# Altium schematic sheet Analog Hall.SchDoc
size A4; CompanyName: Technische Hochschule Nürnberg Georg Simon Ohm; Organization: UltraZohm; Address1: Kesslerplatz 12; Address2: 90489 Nürnberg; Address3: GERMANY; DocumentNumber: 3; SheetNumber: 3; SheetTotal: 12; Website: www.ultrazohm.com
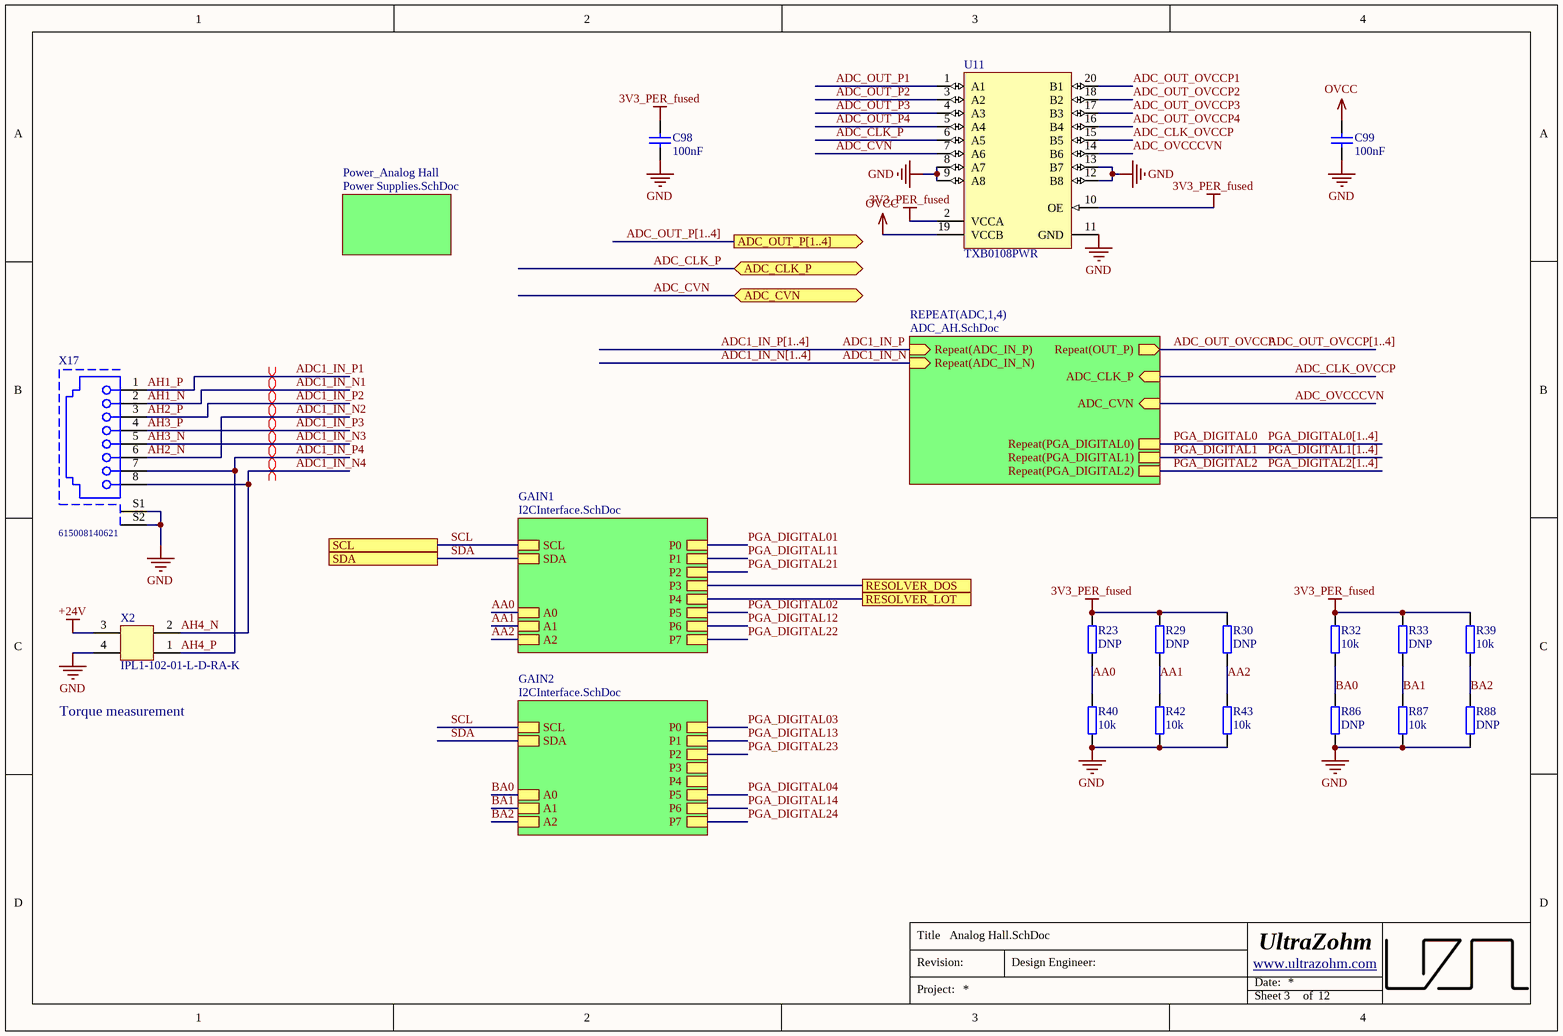
[diagram p0: Analog Hall.SchDoc]

## Parts
C98  100nF  [CAPC1608X07N]
C99  100nF  [CAPC1608X07N]
R23  DNP  [RESC1608X06N]
R29  DNP  [RESC1608X06N]
R30  DNP  [RESC1608X06N]
R32  10k  [RESC1608X06N]
R33  DNP  [RESC1608X06N]
R39  10k  [RESC1608X06N]
R40  10k  [RESC1608X06N]
R42  10k  [RESC1608X06N]
R43  10k  [RESC1608X06N]
R86  DNP  [RESC1608X06N]
R87  10k  [RESC1608X06N]
R88  DNP  [RESC1608X06N]
U11  TXB0108PWR  [PW0020A_L]
X2  IPL1-102-01-L-D-RA-K  [Conector 2x2 TH Horizontal]
X17  615008140621  [615008140621]

## Sub-sheets
GAIN1 = I2CInterface.SchDoc: P4, P7, SDA, P2, P1, A1, A2, P3, P6, SCL, A0, P0, P5
GAIN2 = I2CInterface.SchDoc: P4, P7, SDA, P2, P1, A1, A2, P3, P6, SCL, A0, P0, P5
Power_Analog Hall = Power Supplies.SchDoc: no entries
REPEAT(ADC,1,4) = ADC_AH.SchDoc: Repeat(ADC_IN_N) (in), Repeat(ADC_IN_P) (in), Repeat(OUT_P) (out), ADC_CLK_P (in), ADC_CVN (in), Repeat(PGA_DIGITAL0), Repeat(PGA_DIGITAL1), Repeat(PGA_DIGITAL2)

## Ports
ADC_CLK_P (bidir), ADC_CVN (bidir), ADC_OUT_P[1..4] (out), RESOLVER_DOS, RESOLVER_LOT, SCL, SDA

## Nets
3V3_PER_fused: C98.1 R23.2 R29.2 R30.2 R32.1 R33.1 R39.1 U11.2(VCCA) U11.10(OE)
+24V: X2.3
GND: C98.2 C99.2 R40.1 R42.1 R43.1 R86.2 R87.2 R88.2 U11.8(A7) U11.9(A8) U11.11(GND) U11.12(B8) U11.13(B7) X2.4 X17.S1 X17.S2
OVCC: C99.1 U11.19(VCCB)
AA0: R23.1 R40.2 ; sheet GAIN1/A0
AA1: R29.1 R42.2 ; sheet GAIN1/A1
AA2: R30.1 R43.2 ; sheet GAIN1/A2
ADC1_IN_N: sheet REPEAT(ADC,1,4)/Repeat(ADC_IN_N)
ADC1_IN_N1: X17.2  [also labelled AH1_N]
ADC1_IN_N2: X17.6  [also labelled AH2_N]
ADC1_IN_N3: X17.5  [also labelled AH3_N]
ADC1_IN_N4: X2.2 X17.8  [also labelled AH4_N]
ADC1_IN_P: sheet REPEAT(ADC,1,4)/Repeat(ADC_IN_P)
ADC1_IN_P1: X17.1  [also labelled AH1_P]
ADC1_IN_P2: X17.3  [also labelled AH2_P]
ADC1_IN_P3: X17.4  [also labelled AH3_P]
ADC1_IN_P4: X2.1 X17.7  [also labelled AH4_P]
ADC_CLK_OVCCP: U11.15(B5) ; sheet REPEAT(ADC,1,4)/ADC_CLK_P
ADC_CLK_P: U11.6(A5) ; port ADC_CLK_P
ADC_CVN: U11.7(A6) ; port ADC_CVN
ADC_OUT_OVCCP: sheet REPEAT(ADC,1,4)/Repeat(OUT_P)
ADC_OUT_OVCCP1: U11.20(B1)
ADC_OUT_OVCCP2: U11.18(B2)
ADC_OUT_OVCCP3: U11.17(B3)
ADC_OUT_OVCCP4: U11.16(B4)
ADC_OUT_P1: U11.1(A1)
ADC_OUT_P2: U11.3(A2)
ADC_OUT_P3: U11.4(A3)
ADC_OUT_P4: U11.5(A4)
ADC_OVCCCVN: U11.14(B6) ; sheet REPEAT(ADC,1,4)/ADC_CVN
BA0: R32.2 R86.1 ; sheet GAIN2/A0
BA1: R33.2 R87.1 ; sheet GAIN2/A1
BA2: R39.2 R88.1 ; sheet GAIN2/A2
PGA_DIGITAL0: sheet REPEAT(ADC,1,4)/Repeat(PGA_DIGITAL0)
PGA_DIGITAL1: sheet REPEAT(ADC,1,4)/Repeat(PGA_DIGITAL1)
PGA_DIGITAL01: sheet GAIN1/P0
PGA_DIGITAL2: sheet REPEAT(ADC,1,4)/Repeat(PGA_DIGITAL2)
PGA_DIGITAL02: sheet GAIN1/P5
PGA_DIGITAL03: sheet GAIN2/P0
PGA_DIGITAL04: sheet GAIN2/P5
PGA_DIGITAL11: sheet GAIN1/P1
PGA_DIGITAL12: sheet GAIN1/P6
PGA_DIGITAL13: sheet GAIN2/P1
PGA_DIGITAL14: sheet GAIN2/P6
PGA_DIGITAL21: sheet GAIN1/P2
PGA_DIGITAL22: sheet GAIN1/P7
PGA_DIGITAL23: sheet GAIN2/P2
PGA_DIGITAL24: sheet GAIN2/P7
RESOLVER_DOS: port RESOLVER_DOS, sheet GAIN1/P3
RESOLVER_LOT: port RESOLVER_LOT, sheet GAIN1/P4
SCL: port SCL, sheet GAIN1/SCL, sheet GAIN2/SCL
SDA: port SDA, sheet GAIN1/SDA, sheet GAIN2/SDA

## Buses and harness runs
bus ADC1_IN_N[1..4]
bus ADC1_IN_P[1..4]
bus ADC_OUT_OVCCP[1..4]
bus ADC_OUT_P[1..4] = port ADC_OUT_P[1..4]
bus PGA_DIGITAL0[1..4]
bus PGA_DIGITAL1[1..4]
bus PGA_DIGITAL2[1..4]

## Layout directives
differential pair: ADC1_IN_N1, ADC1_IN_N2, ADC1_IN_N3, ADC1_IN_N4, ADC1_IN_P1, ADC1_IN_P2, ADC1_IN_P3, ADC1_IN_P4

## Notes on the sheet
- (near X2) Torque measurement
- Title
- Revision:
- Design Engineer:
- Date:
- Project:
- Sheet
- of

## Library data of the parts
C98 = Cap_0603: MPN: 885012206071; MF: Würth; Voltage: 25V; Value: 100nF; Supplier 1: Mouser; Supplier 2: *; Supplier Part Number 1: 710-885012206071; Supplier Part Number 2: *
C99 = Cap_0603: MPN: 885012206071; MF: Würth; Voltage: 16V; Value: 100nF; Supplier 1: Mouser; Supplier 2: *; Supplier Part Number 1: 710-885012206071; Supplier Part Number 2: *
R23 R29 R30 R32 R33 R39 R40 R42 R43 R86-R88 = R_0603: MPN: CRCW06030000Z0EAC; MF: Vishay; Supplier 1: Mouser; Supplier Part Number 1: 71-CRCW06030000Z0EAC
  R23 R29 R30 R33 R86 R88: Value: DNP
  R32 R39 R40 R42 R43 R87: Value: 10k
U11 = CMP-2000-07337-1: TXB0108 8-Bit Bidirectional Voltage-Level Translator with Auto-Direction Sensing and / +/- 15-kV ESD Protection, 1.2 to 3.6 V, -40 to 85 degC, 20-Pin TSSOP (PW), Green (RoHS & no Sb/Br), Tape and Reel; Manufacturer: Texas Instruments; Propagation Delay (Max): 4ns; Logic Function: Translator,Bidirectional; Input Type: Logic; Package Version: 4040064-5/G, 02/2011; Voltage - Supply: 1.2V~3.6V,1.65V~5.5V; Data Rate: 100Mbps; Other Names: 296-21527-6; Number of Channels: 8; Differential - Input: Output:No/No; Number of Outputs/Channel: 1; Product Training Modules: VoltageLevelTranslation; Dynamic Catalog: TXBSeries; Package Reference: PW20; Package Description: 20-Pin Small Outline Package Integrated Circuit, Body 6.5 x 4.4 mm, Pitch 0.65 mm; Category: IntegratedCircuits(ICs); Datasheet URL: http://www.ti.com/general/docs/lit/getliterature.tsp?genericPartNumber=TXB0108&fileType=pdf; Package / Case: 20-TSSOP(0.173",4.40mmWidth); Family: Logic-Translators; Standard Package: 1; Series: -; Manufacturer URL: http://www.ti.com/; Number of Bits: 8; Package URL: http://www.ti.com/litv/pdf/mpds362; Output Type: Logic; Datasheet Version: Rev. F, 12/2014; Packaging: Digi-Reel®; Operating Temperature: -40°C~85°C; Supplier Device Package: 20-TSSOP; Mounting Technology: SurfaceMount
X2 = Conector 2x2 Horizontal: CONN HEADER R/A 4 POS 2.54MM Through Hole; MF: Samtec; Supplier Part Number 2: SAM8823-ND; MPN: IPL1-102-01-L-D-RA-K; Supplier Part Number 1: 200-IPL110201LDRAK; Supplier 1: Mouser; Supplier 2: Digi-Key
X17 = 615008140621: Modular Jack WR-MJ, Tab Up, Shielded, with EMI Panel Finger, Horizontal Entry, THT, 8P8C; Working Voltage: 120VAC; MF: Wurth Elektronik; Compliance: Leadfree/RoHS; Contact Resistance: 20mOhm; Rated Current: 1.5A; Withstanding Voltage: 1000VAC; Port: 1x1; Entrance: Horizontal; Manufacturer URL: http://www.we-online.de; MPN: 615008140621; Mounting Technology: THT; Operating Temperature: -40to85degC; Packaging: Tray; Pin Number: 8P8C; Package Reference: 615008140621; Datasheet URL: https://katalog.we-online.de/em/datasheet/615008140621.pdf; Publisher: WurthElektronik; Supplier Part Number 1: 710-615008140621; Supplier Part Number 2: 732-2742-ND; Supplier 1: Mouser; Supplier 2: Digi-Key